# Altium schematic sheet DistribPower_RELAY.SchDoc
size 594 x 420 mm; DocumentNumber: РД-11.02.00 Э3; SheetNumber: 2; Format: A2
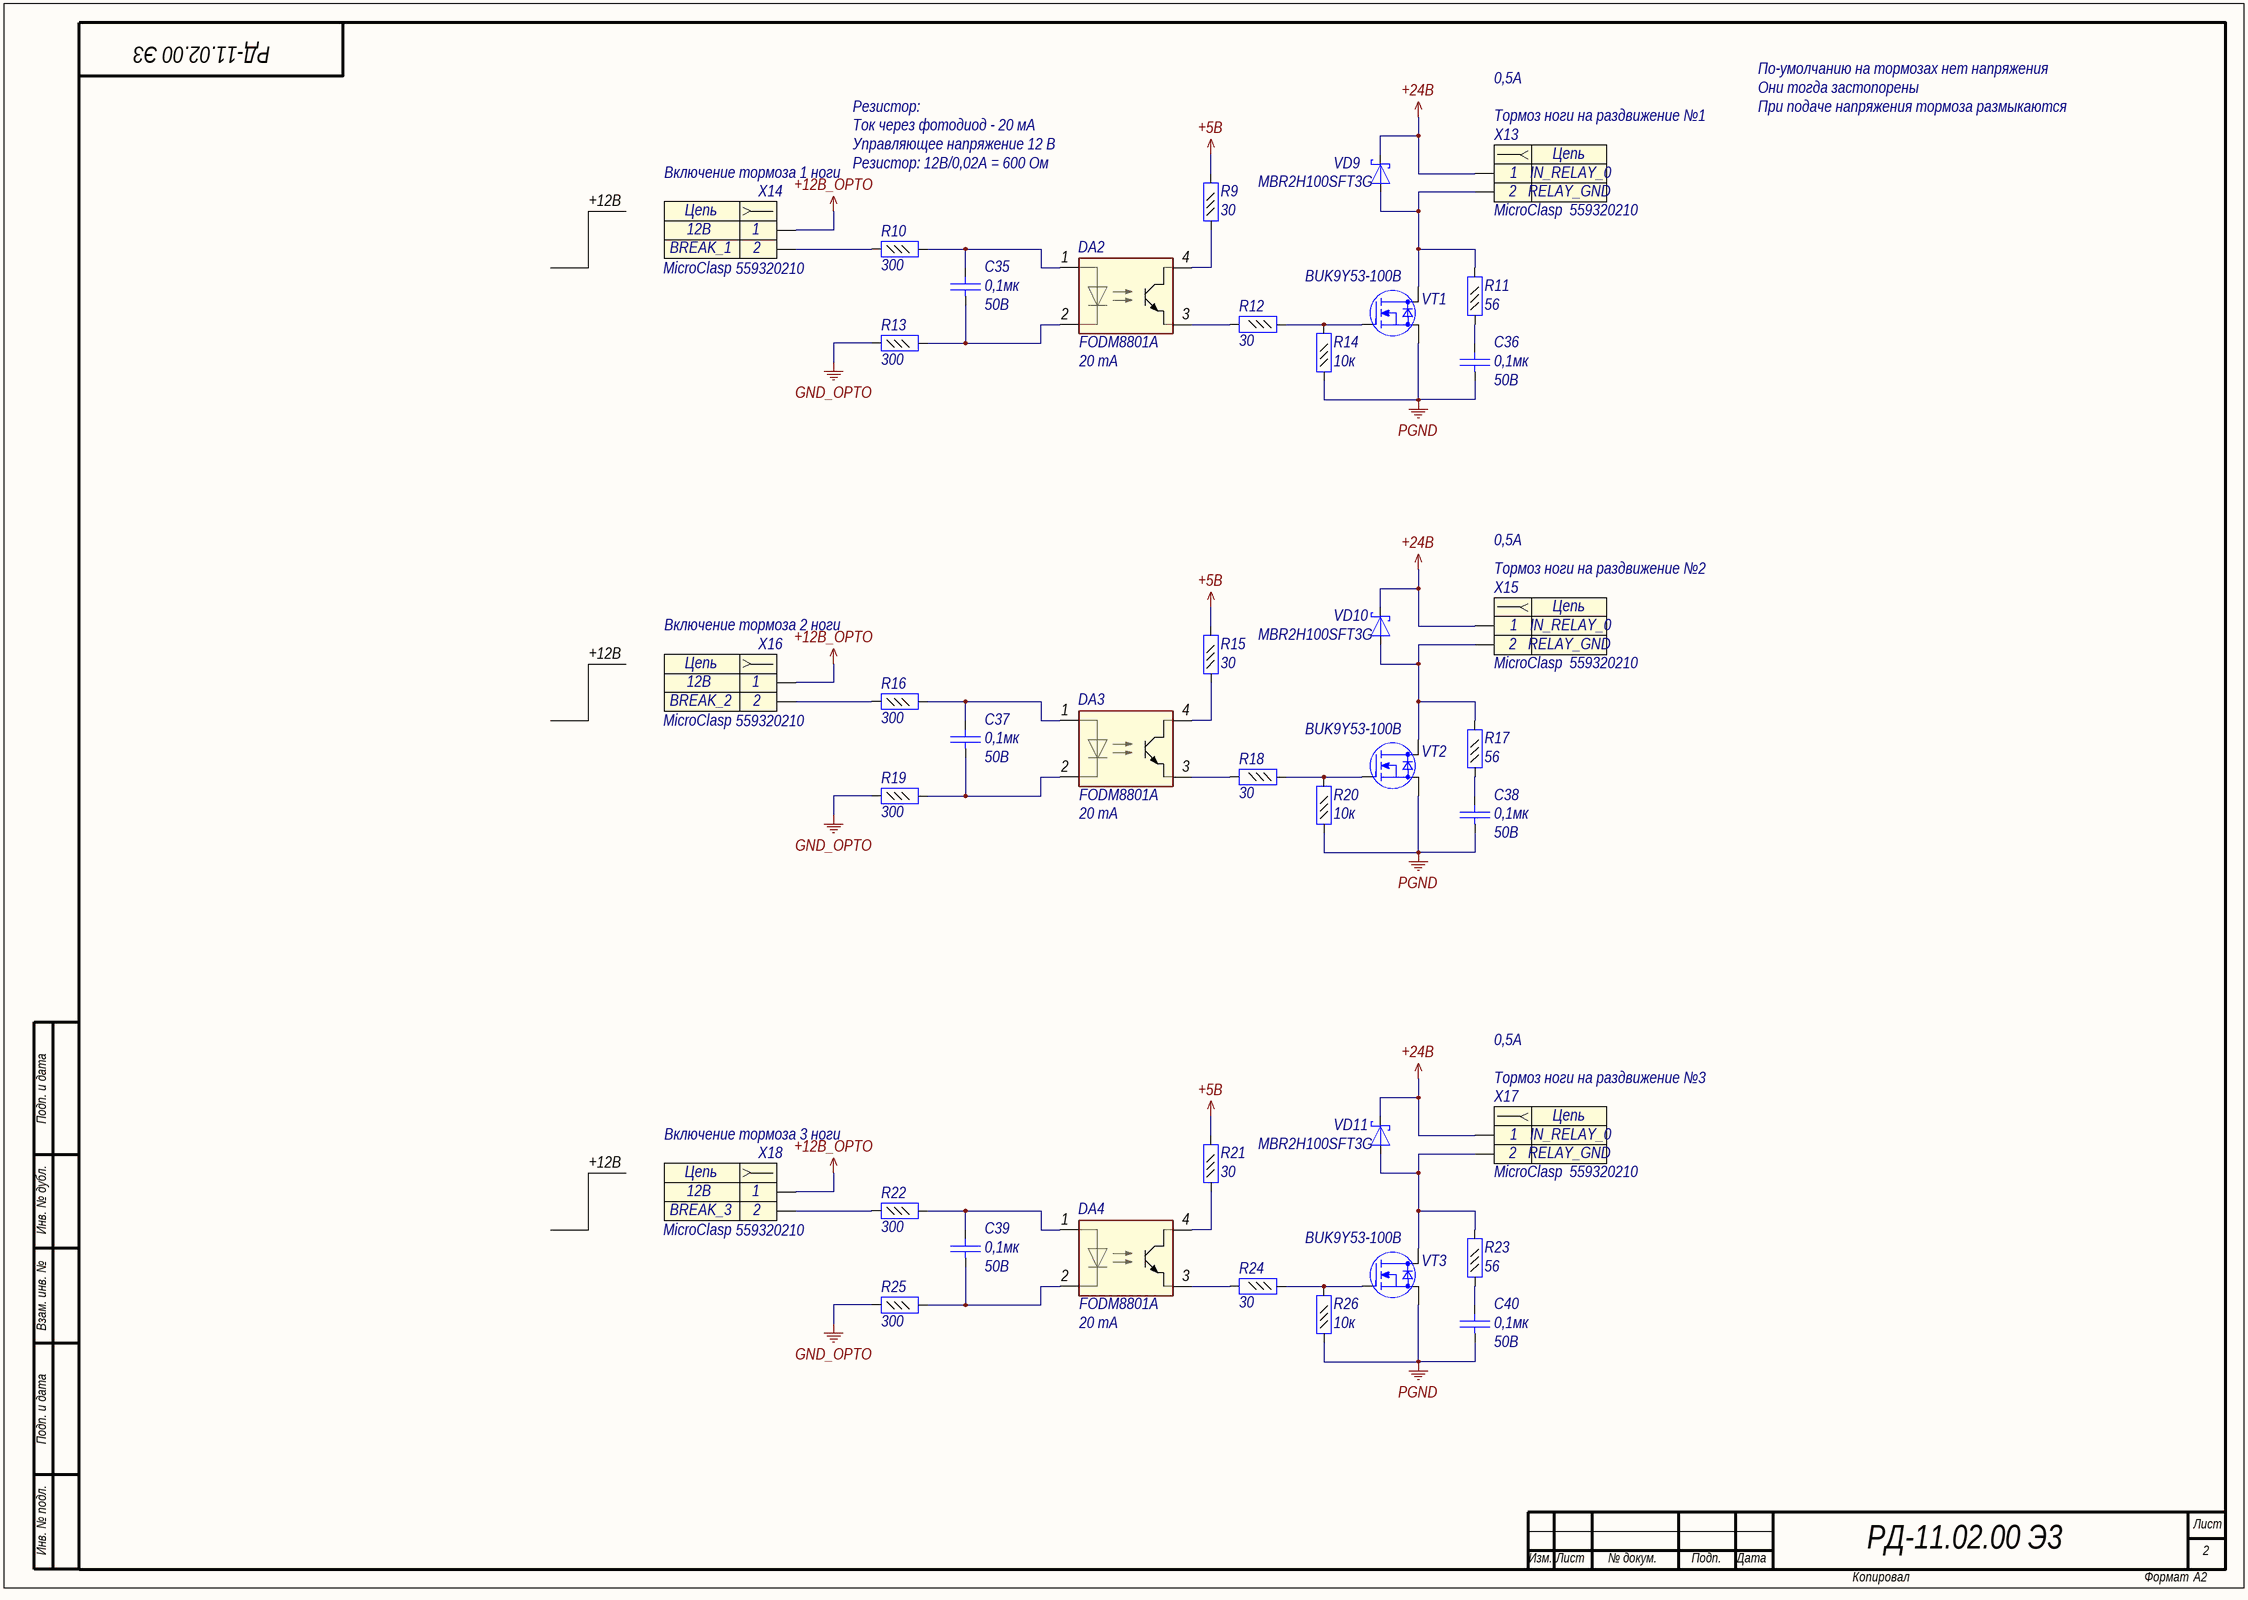
[diagram p0: DistribPower_RELAY.SchDoc]

## Parts
C35  Voltage: 50В  [C0402]  (hidden comment: 0,1мк)
C36  Voltage: 50В  [C0402]  (hidden comment: 0,1мк)
C37  Voltage: 50В  [C0402]  (hidden comment: 0,1мк)
C38  Voltage: 50В  [C0402]  (hidden comment: 0,1мк)
C39  Voltage: 50В  [C0402]  (hidden comment: 0,1мк)
C40  Voltage: 50В  [C0402]  (hidden comment: 0,1мк)
DA2  Part Number: FODM8801A  [Miniflat4]  (hidden comment: OPTO-1)
DA3  Part Number: FODM8801A  [Miniflat4]  (hidden comment: OPTO-1)
DA4  Part Number: FODM8801A  [Miniflat4]  (hidden comment: OPTO-1)
R9  value 30  [R0402]  (hidden comment: Resistor_0,062Вт)
R10  value 300  [R0402]  (hidden comment: Resistor_0,062Вт)
R11  value 56  [R0402]  (hidden comment: Resistor_0,062Вт)
R12  value 30  [R0402]  (hidden comment: Resistor_0,062Вт)
R13  value 300  [R0402]  (hidden comment: Resistor_0,062Вт)
R14  value 10к  [R0402]  (hidden comment: Resistor_0,062Вт)
R15  value 30  [R0402]  (hidden comment: Resistor_0,062Вт)
R16  value 300  [R0402]  (hidden comment: Resistor_0,062Вт)
R17  value 56  [R0402]  (hidden comment: Resistor_0,062Вт)
R18  value 30  [R0402]  (hidden comment: Resistor_0,062Вт)
R19  value 300  [R0402]  (hidden comment: Resistor_0,062Вт)
R20  value 10к  [R0402]  (hidden comment: Resistor_0,062Вт)
R21  value 30  [R0402]  (hidden comment: Resistor_0,062Вт)
R22  value 300  [R0402]  (hidden comment: Resistor_0,062Вт)
R23  value 56  [R0402]  (hidden comment: Resistor_0,062Вт)
R24  value 30  [R0402]  (hidden comment: Resistor_0,062Вт)
R25  value 300  [R0402]  (hidden comment: Resistor_0,062Вт)
R26  value 10к  [R0402]  (hidden comment: Resistor_0,062Вт)
VD9  Part Number: MBR2H100SFT3G  [SOD-123]  (hidden comment: DiodeSchottky)
VD10  Part Number: MBR2H100SFT3G  [SOD-123]  (hidden comment: DiodeSchottky)
VD11  Part Number: MBR2H100SFT3G  [SOD-123]  (hidden comment: DiodeSchottky)
VT1  Part Number: BUK9Y53-100B  [SOT669]  (hidden comment: N-MOSFET)
VT2  Part Number: BUK9Y53-100B  [SOT669]  (hidden comment: N-MOSFET)
VT3  Part Number: BUK9Y53-100B  [SOT669]  (hidden comment: N-MOSFET)
X13  Тормоз ноги на раздвижение №1  Part Name: MicroClasp  Part Number: 559320210  [MOLEX_559320210]
X14  Включение тормоза 1 ноги  Part Name: MicroClasp  Part Number: 559320210  [MOLEX_559320210]
X15  Тормоз ноги на раздвижение №2  Part Name: MicroClasp  Part Number: 559320210  [MOLEX_559320210]
X16  Включение тормоза 2 ноги  Part Name: MicroClasp  Part Number: 559320210  [MOLEX_559320210]
X17  Тормоз ноги на раздвижение №3  Part Name: MicroClasp  Part Number: 559320210  [MOLEX_559320210]
X18  Включение тормоза 3 ноги  Part Name: MicroClasp  Part Number: 559320210  [MOLEX_559320210]

## Nets
+5B: R9.2 R15.2 R21.2
+12B_OPTO: X14.1 X16.1 X18.1
+24B: VD9.1(K) VD10.1(K) VD11.1(K) X13.1 X15.1 X17.1
GND_OPTO: R13.1 R19.1 R25.1
PGND: C36.1 C38.1 C40.1 R14.1 R20.1 R26.1 VT1.3(S) VT2.3(S) VT3.3(S)
NetC35_1: C35.1 DA2.2 R13.2
NetC35_2: C35.2 DA2.1 R10.2
NetC36_2: C36.2 R11.1
NetC37_1: C37.1 DA3.2 R19.2
NetC37_2: C37.2 DA3.1 R16.2
NetC38_2: C38.2 R17.1
NetC39_1: C39.1 DA4.2 R25.2
NetC39_2: C39.2 DA4.1 R22.2
NetC40_2: C40.2 R23.1
NetDA2_3: DA2.3 R12.2
NetDA2_4: DA2.4 R9.1
NetDA3_3: DA3.3 R18.2
NetDA3_4: DA3.4 R15.1
NetDA4_3: DA4.3 R24.2
NetDA4_4: DA4.4 R21.1
NetR10_1: R10.1 X14.2
NetR11_2: R11.2 VD9.2(A) VT1.2(D) X13.2
NetR12_1: R12.1 R14.2 VT1.1(G)
NetR16_1: R16.1 X16.2
NetR17_2: R17.2 VD10.2(A) VT2.2(D) X15.2
NetR18_1: R18.1 R20.2 VT2.1(G)
NetR22_1: R22.1 X18.2
NetR23_2: R23.2 VD11.2(A) VT3.2(D) X17.2
NetR24_1: R24.1 R26.2 VT3.1(G)

## Notes on the sheet
- Резистор:
- 0,5А
- По-умолчанию на тормозах нет напряжения
- Они тогда застопорены
- При подаче напряжения тормоза размыкаются
- Ток через фотодиод - 20 мА
- Управляющее напряжение 12 В
- Резистор: 12В/0,02А = 600 Ом
- +12B
- (near DA2) 20 mA
- (near DA3) 20 mA
- Подп. и дата
- Инв. № дубл.
- Взам. инв. №
- (near DA4) 20 mA
- Инв. № подл.
- Лист
- Изм.
- № докум.
- Подп.
- Дата
- Копировал
- Формат
- (in symbol connect95) Цепь

## Library data of the parts
C35-C40 = cap277: Конденсатор; Part Name: Ceramic; Manufacture: Murata; Part Number: GRM155R71H104KE14D; id: cap277; TKE: X7R; tga: 0,10%; Value: 0,1мк
DA2-DA4 = FODM8801A: Опторазвязка; Manufacturer: ON Semiconductor; id: opto2; Forward current: 20мА; Forward Voltage: 1,8B; Reverse voltage: 6B; Continuous collector current: 30mA; Voltage coll-emmiter: 75B; Max tempreture: +125; Min tempreture: -40; Power dissipation: 300mW
R9 R12 R15 R18 R21 R24 = res233: Резистор; Manufacture: Yageo; Part Number: RC0402FR-0730RL; id: res233; Accuracy: 0,01; Part Name: Resistor; Power: 0,062Вт
R10 R13 R16 R19 R22 R25 = res257: Резистор; Manufacture: Yageo; Part Number: RC0402FR-07300RL; id: res257; Accuracy: 0,01; Part Name: Resistor; Power: 0,062Вт
R11 R17 R23 = res240: Резистор; Manufacture: Yageo; Part Number: RC0402FR-0756RL; id: res240; Accuracy: 0,01; Part Name: Resistor; Power: 0,062Вт
R14 R20 R26 = res294: Резистор; Manufacture: Yageo; Part Number: RC0402FR-0710KL; id: res294; Accuracy: 0,01; Part Name: Resistor; Power: 0,062Вт
VD9-VD11 = diode27: Диод Шоттки; Manufacture: ON Semiconductor; Max Reverse Voltage: 100B; Forward Current: 2А; Breakdown Current: 0,5mA; Number of Channels: 1; id: diode27; Part Name: Diode Schottky; Breakdown Voltage: 100B
VT1-VT3 = mosfert22: Manufacturer: Nexperia; Structure: n-channel; V drain-source max: 100B; Rds: 0,045Ohm; Gate-to-source voltage: (+-)15B; Continuous drain current: 23A; Total gate charge: 18nC; Pulsed drain current: 94A; Power dissipation: 75W; id: mosfert22
X13 X15 X17 = connect95: Разъем - 2 конт. розетка; Manufacture: Molex; Contact_1: IN_RELAY_0; Contact_2: RELAY_GND; Etch: 2mm; id: connect95
X14 = connect95: Разъем - 2 конт. розетка; Manufacture: Molex; Contact_1: 12B; Contact_2: BREAK_1; Etch: 2mm; id: connect95
X16 = connect95: Разъем - 2 конт. розетка; Manufacture: Molex; Contact_1: 12B; Contact_2: BREAK_2; Etch: 2mm; id: connect95
X18 = connect95: Разъем - 2 конт. розетка; Manufacture: Molex; Contact_1: 12B; Contact_2: BREAK_3; Etch: 2mm; id: connect95